# EAGLE design KwanBadgerStick (EAGLE 6.2)
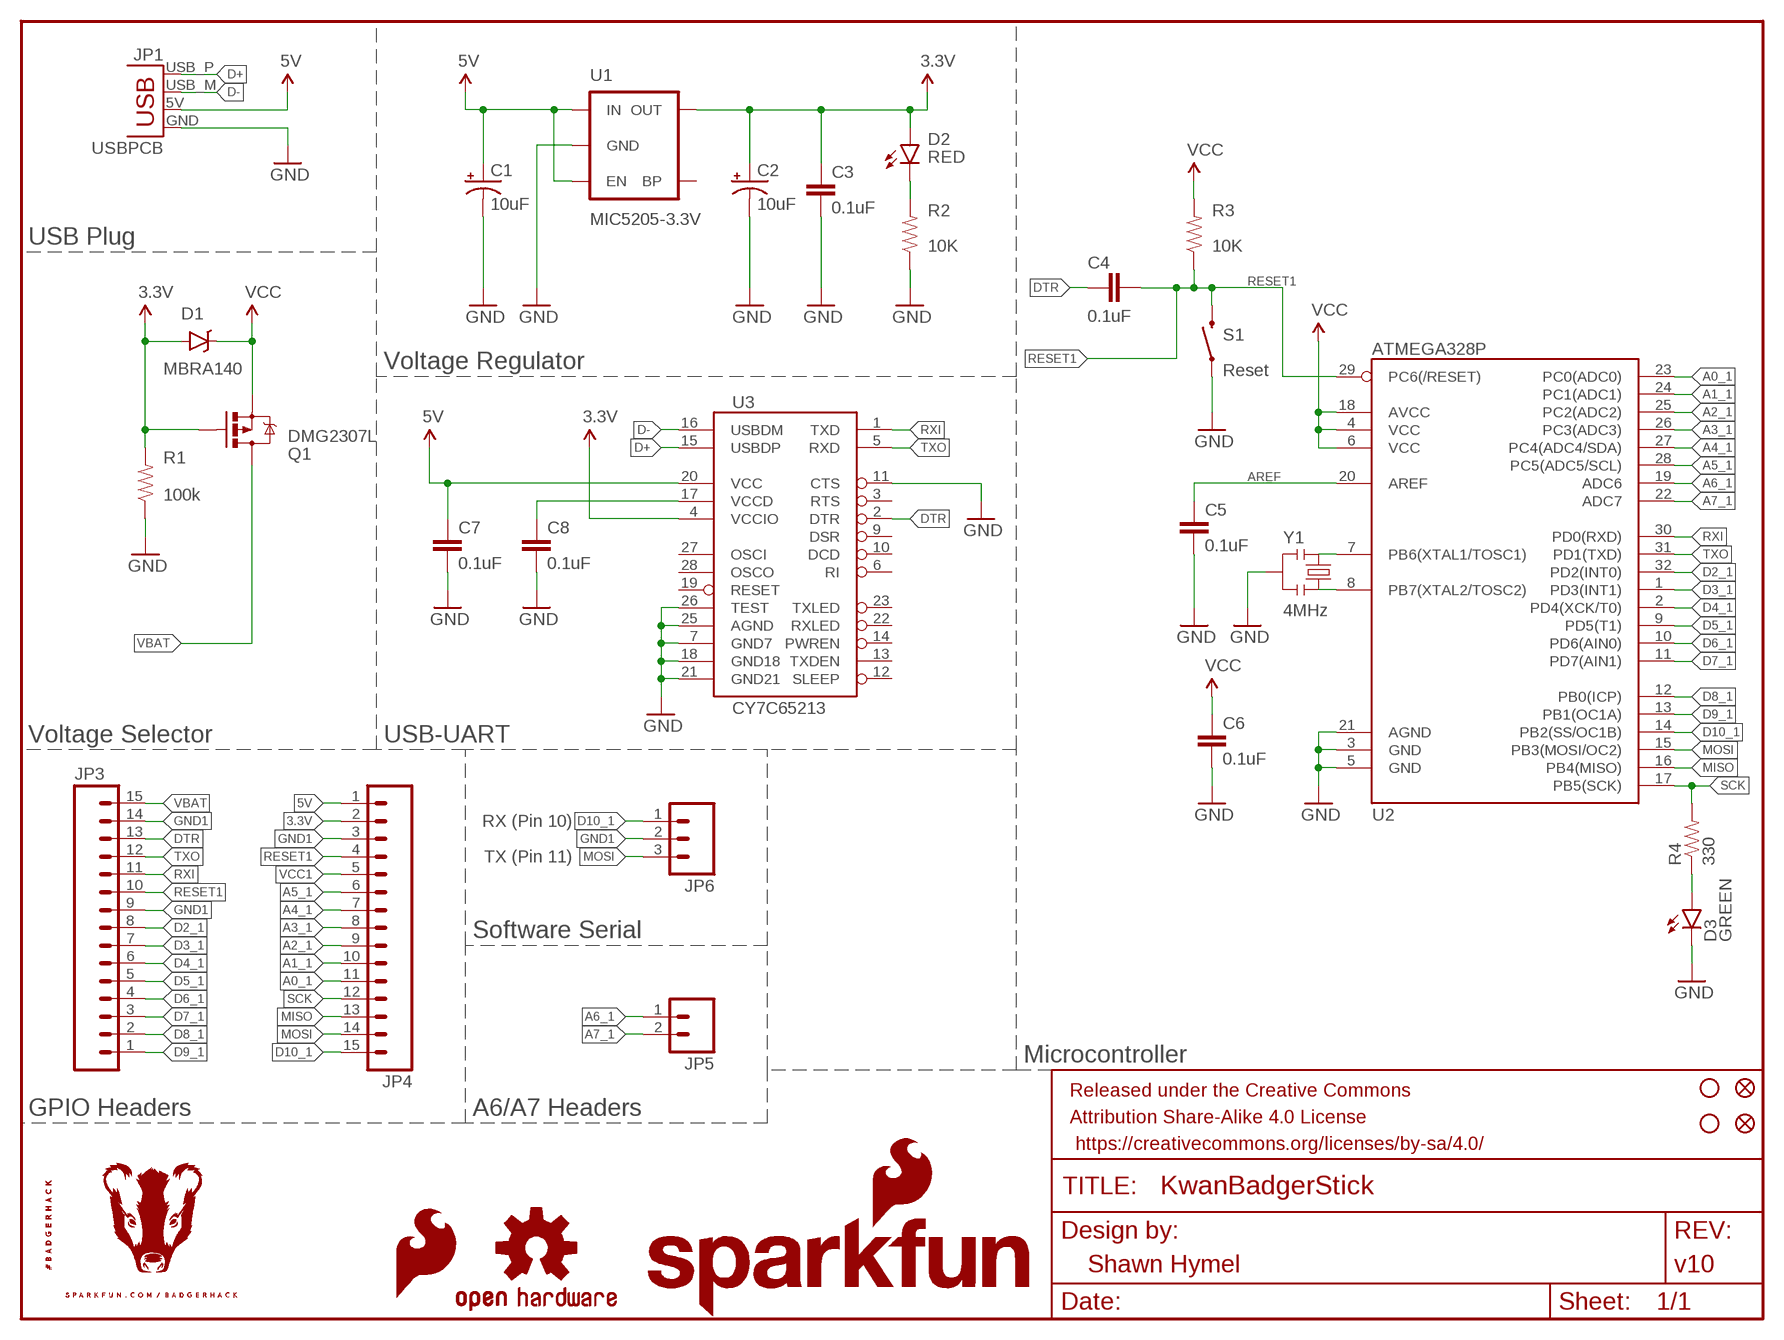
[diagram p0: schematic, sheet 1]

## Parts
C1  10uF  10UF-16V-10%(TANT)  [EIA3216]
C2  10uF  10UF-16V-10%(TANT)  [EIA3216]
C3  0.1uF  0.1UF-25V(+80/-20%)(0603)  [0603-CAP]
C4  0.1uF  0.1UF-25V(+80/-20%)(0603)  [0603-CAP]
C5  0.1uF  0.1UF-25V(+80/-20%)(0603)  [0603-CAP]
C6  0.1uF  0.1UF-25V(+80/-20%)(0603)  [0603-CAP]
C7  0.1uF  0.1UF-25V(+80/-20%)(0603)  [0603-CAP]
C8  0.1uF  0.1UF-25V(+80/-20%)(0603)  [0603-CAP]
D1  MBRA140  DIODE-SCHOTTKY-MBRA140  [SMA-DIODE]
D2  RED  LED-RED0603  [LED-0603]
D3  GREEN  LED-GREEN0603  [LED-0603]
FID1  FIDUCIAL1X2  [FIDUCIAL-1X2]
FID2  FIDUCIAL1X2  [FIDUCIAL-1X2]
FRAME1  FRAME-LETTER  [CREATIVE_COMMONS]
JP1  USBPCB  [USB-A-PCB]
JP3  M15LOCK_NO_SILK  [1X15_LOCK_NO_SILK]
JP4  M15LOCK_NO_SILK  [1X15_LOCK_NO_SILK]
JP5  M021X02_NO_SILK  [1X02_NO_SILK]
JP6  M03LOCK Female  M03LOCK_NO_SILK  [1X03_LOCK_NO_SILK]
LOGO1  SFE_LOGO_FLAME.1_INCH  [SFE_LOGO_FLAME_.1]
LOGO2  OSHW-LOGOS  [OSHW-LOGO-S]
Q1  DMG2307L  MOSFET-PCHANNELDMG2307L  [SOT23-3]
R1  100k  100KOHM-1/10W-1%(0603)  [0603-RES]
R2  10K  10KOHM-1/10W-1%(0603)0603  [0603-RES]
R3  10K  10KOHM-1/10W-1%(0603)0603  [0603-RES]
R4  330  330OHM1/10W1%(0603)  [0603-RES]
S1  SWITCH-MOMENTARY-2SMD-REDUNDANT  [TACTILE-SWITCH-SMD]
STANDOFF1  STAND-OFF  [STAND-OFF]
STANDOFF2  STAND-OFF  [STAND-OFF]
U1  MIC5205-3.3V  MIC52053.3V  [SOT23-5]
U2  ATMEGA328P  ATMEGA328_SMT  [TQFP32-08]
U3  CY7C65213  [SSOP28DB]
U$1  SFE_LOGO_NAME_FLAME.1_INCH  [SFE_LOGO_NAME_FLAME_.1]
U$2  BADGERHACK_LOGODUMMY  [DUMMY]
Y1  4MHz  RESONATOR4MHZ  [RESONATOR-SMD_MED]

## Nets
3.3V: C2.A(+) C3.1 D1.A D2.A JP4.2 Q1.1(G) R1.2 U1.5(OUT) U3.4(VCCIO)
5V: C1.A(+) C7.1 JP1.5V(VBUS) JP4.1 U1.1(IN) U1.3(EN) U3.20(VCC)
A0_1: JP4.11 U2.23(PC0(ADC0))
A1_1: JP4.10 U2.24(PC1(ADC1))
A2_1: JP4.9 U2.25(PC2(ADC2))
A3_1: JP4.8 U2.26(PC3(ADC3))
A4_1: JP4.7 U2.27(PC4(ADC4/SDA))
A5_1: JP4.6 U2.28(PC5(ADC5/SCL))
A6_1: JP5.1 U2.19(ADC6)
A7_1: JP5.2 U2.22(ADC7)
AREF: C5.1 U2.20(AREF)
D2_1: JP3.8 U2.32(PD2(INT0))
D3_1: JP3.7 U2.1(PD3(INT1))
D4_1: JP3.6 U2.2(PD4(XCK/T0))
D5_1: JP3.5 U2.9(PD5(T1))
D6_1: JP3.4 U2.10(PD6(AIN0))
D7_1: JP3.3 U2.11(PD7(AIN1))
D8_1: JP3.2 U2.12(PB0(ICP))
D9_1: JP3.1 U2.13(PB1(OC1A))
D10_1: JP4.15 JP6.1 U2.14(PB2(SS/OC1B))
D+: JP1.USB_P(D+) U3.15(USBDP)
D-: JP1.USB_M(D-) U3.16(USBDM)
DTR: C4.1 JP3.13 U3.2(DTR)
GND1: C1.C(-) C2.C(-) C3.2 C5.2 C6.2 C7.2 C8.2 D3.C JP1.GND JP3.9 JP3.14 JP4.3 JP6.2 R1.1 R2.1 S1.1 S1.2 U1.2(GND) U2.3(GND) U2.5(GND) U2.21(AGND) U3.7(GND7) U3.11(CTS) U3.18(GND18) U3.21(GND21) U3.25(AGND) U3.26(TEST) Y1.2 ; supply symbol labelled GND
MISO: JP4.13 U2.16(PB4(MISO))
MOSI: JP4.14 JP6.3 U2.15(PB3(MOSI/OC2))
N$1: D3.A R4.1
N$2: C8.1 U3.17(VCCD)
N$4: D2.C R2.2
N$5: U2.7(PB6(XTAL1/TOSC1)) Y1.1
N$6: U2.8(PB7(XTAL2/TOSC2)) Y1.3
RESET1: C4.2 JP3.10 JP4.4 R3.1 S1.3 S1.4 U2.29(PC6(/RESET))
RXI: JP3.11 U2.30(PD0(RXD)) U3.1(TXD)
SCK: JP4.12 R4.2 U2.17(PB5(SCK))
TXO: JP3.12 U2.31(PD1(TXD)) U3.5(RXD)
VBAT: JP3.15 Q1.3(D)
VCC1: C6.1 D1.C JP4.5 Q1.2(S) R3.2 U2.4(VCC) U2.6(VCC) U2.18(AVCC) ; supply symbol labelled VCC
Unconnected: U1.4(BP) U3.3(RTS) U3.6(RI) U3.9(DSR) U3.10(DCD) U3.12(SLEEP) U3.13(TXDEN) U3.14(PWREN) U3.19(RESET) U3.22(RXLED) U3.23(TXLED) U3.27(OSCI) U3.28(OSCO)

## Notes on the sheet
- USB Plug
- Voltage Regulator
- Voltage Selector | USB-UART
- RX (Pin 10)
- TX (Pin 11)
- Software Serial
- Microcontroller
- GPIO Headers | A6/A7 Headers

## Library data of the parts
C1 C2 = SparkFun-Capacitors:10UF-16V-10%(TANT): CAP-00811 1206/EIA-3216 Tantalum capacitor; PROD_ID: CAP-00811
C3-C8 = SparkFun-Capacitors:0.1UF-25V(+80/-20%)(0603): CAP-00810 Ceramic Standard decoupling cap; PROD_ID: CAP-00810
D1 = SparkFun-DiscreteSemi:DIODE-SCHOTTKY: Schottky diodes in SFE's production catalog BAT20J 1A 23V 0.62Vf RB751 120mA 40V 0.37Vf PMEG4005EJ 0.5A 40V 0.42Vf MBRA140 1A 40V 0.5Vf B340A 3A 40V SMA; PROD_ID: DIO-08053
D2 = SparkFun-LED:LED-RED: Assorted Red LEDs LilyPad 1206- DIO-09912 1206- DIO-00809 0603- DIO-00819; PROD_ID: DIO-00819
D3 = SparkFun-LED:LED-GREEN: Various green LEDs Green LEDs used in SFE Production 0603- DIO-00821 LARGE- DIO-00862 LILYPAD- DIO-09910; PROD_ID: DIO-00821
FID1 FID2 = SparkFun-Aesthetics:FIDUCIAL: Fiducial Alignment Points Various fiducial points for machine vision alignment.
FRAME1 = SparkFun-Aesthetics:FRAME-LETTER: Schematic Frame Standard 8.5x11 US Letter frame; DESIGNER: Shawn Hymel; VERSION: v10
JP1 = SparkFun-Connectors:USB: USB Connectors USB-B-PTH is fully proven SKU : PRT-00139/CONN-08278 USB-miniB is fully proven SKU : PRT-00587 USB-A-PCB is untested. USB-A-H is throughly reviewed, but untested. Spark Fun Electronics SKU : PRT-00437 USB-B-SMT is throughly reviewed, but untested. Needs silkscreen touching up. USB-A-S has not been used/tested USB-MB-H has not been used/tested USB-MICROB has been used. CONN-09505
JP3 JP4 = SparkFun-Connectors:M15: Header 15 Standard 15-pin 0.1" header. Use with straight break away headers (SKU : PRT-00116), right angle break away headers (PRT-00553), swiss pins (PRT-00743), machine pins (PRT-00117), and female headers (PRT-00115).
JP5 = SparkFun-Connectors:M02: Standard 2-pin 0.1" header. Use with - straight break away headers ( PRT-00116) - right angle break away headers (PRT-00553) - swiss pins (PRT-00743) - machine pins (PRT-00117) - female headers (PRT-00115) Molex polarized connector foot print use with: PRT-08233 with associated crimp pins and housings. 2.54_SCREWTERM for use with PRT-10571. 3.5mm Screw Terminal footprints for PRT-08084 5mm Screw Terminal footprints for use with PRT-08432
JP6 = SparkFun-Connectors:M03: Header 3 Standard 3-pin 0.1" header. Use with straight break away headers (SKU : PRT-00116), right angle break away headers (PRT-00553), swiss pins (PRT-00743), machine pins (PRT-00117), and female headers (PRT-00115). Molex polarized connector foot print use with SKU : PRT-08232 with associated crimp pins and housings.
LOGO1 = SparkFun-Aesthetics:SFE_LOGO_FLAME: SFE Logo, flame only This is the SparkFun flame logo. The logo on the schematic will always be the same size; the package variant is the height of the flame. Default layer for the logo on the board is tSilk.
LOGO2 = SparkFun-Aesthetics:OSHW-LOGO: Open Source Hardware Logo This logo indicates the piece of hardware it is found on incorporates a OSHW license and/or adheres to the definition of open source hardware found here: http://freedomdefined.org/OSHW
Q1 = SparkFun-DiscreteSemi:MOSFET-PCHANNEL: Generic PMOSFET IRLML2244 - TRANS-11153 (SOT-23 -20V -4.3A) (1.Gate 2.Source 3.Drain) FQP27P06 - COM-10349 <http://www.sparkfun.com/products/10349> (TO-220 -60V -27A) (1.Gate 2.Source 3.Drain); PROD_ID: TRANS-11308; VALUE: 2.5A/30V
R1 = SparkFun-Resistors:100KOHM-1/10W-1%(0603): RES-07828; PROD_ID: RES-07828
R2 R3 = SparkFun-Resistors:10KOHM-1/10W-1%(0603): RES-00824; PROD_ID: RES-00824
R4 = SparkFun-Resistors:330OHM1/10W1%(0603): RES-00818; PROD_ID: RES-00818
S1 = SparkFun-Electromechanical:SWITCH-MOMENTARY-2: Various NO switches- pushbuttons, reed, etc; FUNC: Reset; PROD_ID: SWCH-08247
STANDOFF1 STANDOFF2 = SparkFun-Electromechanical:STAND-OFF: #4 Stand Off This is the mechanical footprint for a #4 phillips button head screw. Use the keepout ring to avoid running the screw head into surrounding components. SKU : PRT-00447
U1 = SparkFun-PowerIC:MIC5205: MIC5205 150mA vreg 3.3V - VREG-00822 5V - VREG-00823; PROD_ID: VREG-00822
U2 = SparkFun-DigitalIC:ATMEGA328_SMT: 32-Pin Atmega328 part Commonly used on Arduino compatible boards Available in QFP and QFN packages TQFP is IC-09069 QFN is non-stock; PROD_ID: IC-09069
U3 = SparkFun-DigitalIC:CY7C65213: USB UART CY7C65213 USB-UART controller.; PROD_ID: IC-12487
U$1 = SparkFun-Aesthetics:SFE_LOGO_NAME_FLAME: SFE Logo, name and flame This is the SparkFun full logo. The logo on the schematic will always be the same size; the package variant is the height of the flame part of the logo. Default layer for the logo on the board is tSilk.
U$2 = SparkFun-Aesthetics:BADGERHACK_LOGO
Y1 = SparkFun-FreqCtrl:RESONATOR: Resonator Small SMD resonator. Used, eg, on the Arduino Pro/ Pro Mini boards. 8MHz- XTAL-08895 16MHz- XTAL-08900; PROD_ID: XTAL-12492

## Board
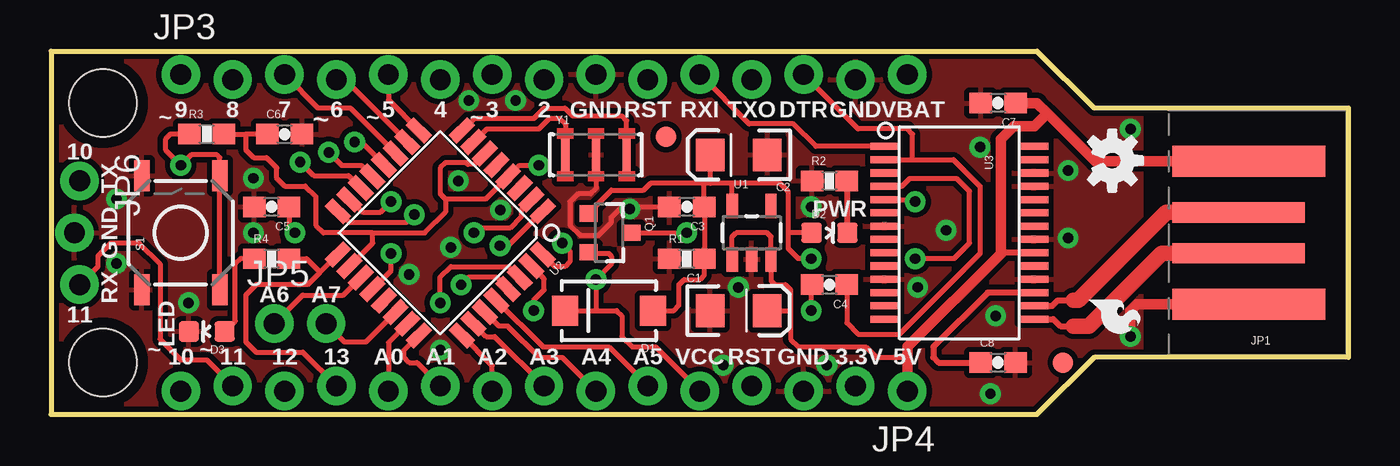
[diagram p1: board, top side]
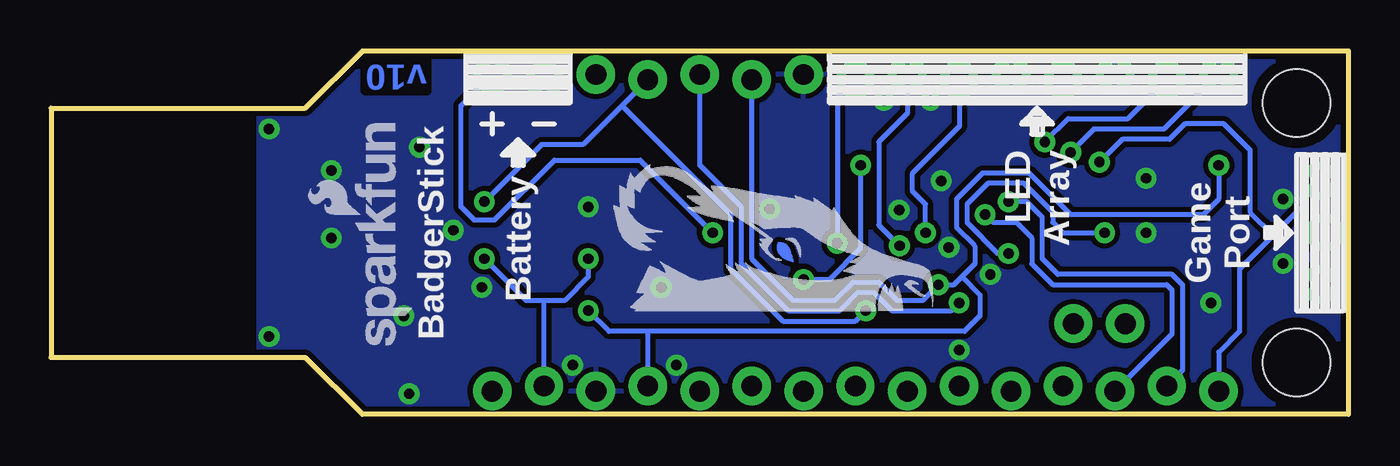
[diagram p2: board, bottom side, seen from below]

Size 63.5 x 17.78 mm. Coordinates in mm from the lower left corner, seen from the top.
Outline: 0,17.78 0,0 48.26,0 51.05,2.79 63.5,2.79 63.5,14.99 51.05,14.99 48.26,17.78 0,17.78
Copper layers (1*16): Top 0.035mm / dielectric 1.5mm / Bottom 0.035mm
Design rules: minimum track width 7mil, minimum drill 15mil, track to track 8mil, track to pad 8mil, pad to pad 8mil, via to via 8mil, smd to smd 8mil, copper to edge 8mil, drill to drill 8mil, minimum pad ring 12mil, minimum via ring 10mil, stop-mask expansion 4mil, vias tented up to drill 20mil, thermal gap 10mil
tRestrict: 3 lines

### Footprints (pad centres in the part's own frame; a part is rotated, then mirrored left to right if it is on the bottom)
EIA3216 = smd 1.4 x 1.6: A 1.4,0; C -1.4,0
0603-CAP = smd 1.1 x 1: 1 -0.85,0; 2 0.85,0
SMA-DIODE = smd 1.27 x 1.47: A -2.15,0; C 2.15,0
LED-0603 = smd 1 x 1: A 0,-0.877; C 0,0.877
FIDUCIAL-1X2 = smd 1 x 1: 1 0,0
USB-A-PCB = smd 7.5 x 1.5: 5V -0.2,-3.5; GND -0.2,3.5 | smd 6.5 x 1: USB_M 0.3,-1; USB_P 0.3,1
1X15_LOCK_NO_SILK = drill 1.016 pad 1.88: 1 0,0.127; 2 2.54,-0.127; 3 5.08,0.127; 4 7.62,-0.127; 5 10.16,0.127; 6 12.7,-0.127; 7 15.24,0.127; 8 17.78,-0.127; 9 20.32,0.127; 10 22.86,-0.127; 11 25.4,0.127; 12 27.94,-0.127; 13 30.48,0.127; 14 33.02,-0.127; 15 35.56,0.127
1X02_NO_SILK = drill 1.016 pad 1.88: 1 0,0; 2 2.54,0
1X03_LOCK_NO_SILK = drill 1.016 pad 1.88: 1 0,0.127; 2 2.54,-0.127; 3 5.08,0.127
SOT23-3 = smd 0.8 x 0.9: 1 -0.95,-1; 2 0.95,-1; 3 0,1.1
0603-RES = smd 1.1 x 1: 1 -0.85,0; 2 0.85,0
TACTILE-SWITCH-SMD = smd 1.524 x 0.762: 1 -2.794,1.905; 2 2.794,1.905; 3 -2.794,-1.905; 4 2.794,-1.905
STAND-OFF = hole 3.302: 0,0
SOT23-5 = smd 0.55 x 1.2: 1 -0.95,-1.3; 2 0,-1.3; 3 0.95,-1.3; 4 0.95,1.3; 5 -0.95,1.3
TQFP32-08 = smd 1.27 x 0.559: 1 -4.293,2.8; 2 -4.293,2; 3 -4.293,1.2; 4 -4.293,0.4; 5 -4.293,-0.4; 6 -4.293,-1.2; 7 -4.293,-2; 8 -4.293,-2.8; 17 4.293,-2.8; 18 4.293,-2; 19 4.293,-1.2; 20 4.293,-0.4; 21 4.293,0.4; 22 4.293,1.2; 23 4.293,2; 24 4.293,2.8 | smd 0.559 x 1.27: 9 -2.8,-4.293; 10 -2,-4.293; 11 -1.2,-4.293; 12 -0.4,-4.293; 13 0.4,-4.293; 14 1.2,-4.293; 15 2,-4.293; 16 2.8,-4.293; 25 2.8,4.293; 26 2,4.293; 27 1.2,4.293; 28 0.4,4.293; 29 -0.4,4.293; 30 -1.2,4.293; 31 -2,4.293; 32 -2.8,4.293
SSOP28DB = smd 0.348 x 1.397: 1 -4.225,-3.656; 2 -3.575,-3.656; 3 -2.925,-3.656; 4 -2.275,-3.656; 5 -1.625,-3.656; 6 -0.975,-3.656; 7 -0.325,-3.656; 8 0.325,-3.656; 9 0.975,-3.656; 10 1.625,-3.656; 11 2.275,-3.656; 12 2.925,-3.656; 13 3.575,-3.656; 14 4.225,-3.656; 15 4.225,3.656; 16 3.575,3.656; 17 2.925,3.656; 18 2.275,3.656; 19 1.625,3.656; 20 0.975,3.656; 21 0.325,3.656; 22 -0.325,3.656; 23 -0.975,3.656; 24 -1.625,3.656; 25 -2.275,3.656; 26 -2.925,3.656; 27 -3.575,3.656; 28 -4.225,3.656
RESONATOR-SMD_MED = smd 0.4 x 1.6: 1 -1.5,0; 2 0,0; 3 1.5,0

### Placement (x,y rotation side)
C1  33.66,5.08 0 top
C2  33.66,12.7 180 top
C3  31.11,10.16 180 top
C4  38.1,6.35 180 top
C5  10.79,10.16 180 top
C6  11.43,13.72 0 top
C7  46.35,15.24 180 top
C8  46.35,2.54 0 top
D1  27.3,5.08 180 top
D2  38.1,8.89 270 top
D3  7.62,4.06 90 top
FID1  30.1,13.59 270 top
FID2  49.53,2.54 270 top
FRAME1  87.63,5.08 0 top  (outside the outline)
JP1  58.42,8.89 180 top
JP3  6.35,16.51 0 top
JP4  41.91,1.27 180 top
JP5  10.92,4.45 0 top
JP6  1.27,11.43 270 top
LOGO1  50.42,5.94 270 top
LOGO2  51.94,12.42 270 top
Q1  27.3,8.89 270 top
R1  31.11,7.62 0 top
R2  38.1,11.43 0 top
R3  7.62,13.72 0 top
R4  10.79,7.62 0 top
S1  6.35,8.89 90 top
STANDOFF1  2.54,2.54 270 top
STANDOFF2  2.54,15.24 270 top
U1  34.29,8.89 0 top
U2  19.05,8.89 225 top
U3  44.45,8.89 270 top
U$1  45.72,2.92 90 bottom
U$2  -60.96,-31.75 0 top  (outside the outline)
U$3  [HALF_BADGER]  20.32,5.08 90 bottom
Y1  26.67,12.7 0 top

### Tracks (layer width: path | path; a pad name or v marks a point on that pad's centre or on a via)
3.3V  (via drill 0.51)
  Top 0.254: D2.A 36.07,8.89 | v37.21,7.62 36.58,7.62 36.07,8.13 36.07,8.89 | 36.07,8.89 36.07,10.92 35.69,11.3 33.27,11.3 | U3.4 41.65,11.16 42.04,11.56 44.32,11.56 44.96,10.92 44.96,8.38 44.2,7.62 v42.29,7.62 | 33.27,11.3 32.26,11.3 | 32.26,11.3 32,11.3 | 32,11.3 29.34,11.3 29.01,10.97 27.43,10.97 27.39,10.93 27.39,10.92 Q1.1 | U1.5 33.34,11.24 33.27,11.3 | 32,11.3 31.96,11.26 C3.1 31.96,9.69 32,9.65 32,8.13 31.96,8.09 R1.2 31.96,6.82 31.75,6.6 30.99,6.6 30.73,6.35 30.73,5.33 30.48,5.08 D1.A | C2.A 32.26,11.31 32.26,11.3
  Bottom 0.254: v37.21,7.62 37.21,6.73 38.35,5.59 39.37,5.59 | 39.37,5.59 40.26,5.59 v42.29,7.62 | JP4.2 39.37,5.59
5V
  Top 0.254: U1.1 33.34,8.7 33.53,8.89 35.05,8.89 35.24,8.7 U1.3 35.24,6.54 35.43,6.35 35.94,6.35 36.2,6.1 36.2,5.08 | 36.2,5.08 36.2,3.68 36.58,3.3 39.88,3.3 40.39,2.79 41.91,2.79 | C1.A 36.2,5.08
  Top 0.305: U3.20 46.52,7.92 46.48,7.87
  Top 0.508: JP1.5V 51.11,12.39 48.77,14.73 | 48.77,14.73 48.26,15.24 C7.1 | 48.77,14.73 48.13,14.1 47.12,14.1 46.48,13.46 46.48,7.87 41.91,3.3 41.91,2.79 JP4.1
A0_1
  Top 0.254: U2.23 16.51,3.52 JP4.11
A1_1
  Top 0.254: U2.24 17.27,3.15 17.27,2.79 17.53,2.54 17.91,2.54 JP4.10
A2_1
  Top 0.254: JP4.9 21.59,2.39 U2.25
A3_1
  Top 0.254: U2.26 21.3,3.81 21.72,3.81 JP4.8
A4_1
  Top 0.254: U2.27 21.93,4.32 22.35,4.32 23.88,2.79 25.02,2.79 JP4.7
A5_1
  Top 0.254: U2.28 24.07,3.3 27.3,3.3 JP4.6
A6_1
  Top 0.254: U2.19 14.3,5.84 12.32,5.84 JP5.1
A7_1
  Top 0.254: U2.22 15.41,3.56 14.35,3.56 JP5.2
AREF  (via drill 0.51)
  Top 0.254: U2.20 16.64,7.04 v16.64,7.87 | C5.1 11.64,9.18 v11.94,8.89
  Bottom 0.254: v16.64,7.87 17.14,7.87 18.67,9.4 18.67,10.29 17.65,11.3 15.88,11.3 14.48,9.91 14.48,9.4 13.97,8.89 v11.94,8.89
D2_1  (via drill 0.51)
  Top 0.254: v25.02,8.38 25.4,8 25.4,7.49 25.15,7.24 24.66,7.24 U2.32
  Bottom 0.254: JP3.8 25.02,15.49 v25.02,8.38
D3_1  (via drill 0.51)
  Top 0.254: U2.1 22.38,8.26 v21.97,8.26
  Bottom 0.254: JP3.7 21.59,14.73 22.99,13.34 22.99,9.27 v21.97,8.26
D4_1  (via drill 0.51)
  Top 0.254: U2.2 23.5,10.47 23.01,9.98 23.01,9.68 22.45,9.12 20.93,9.12 v20.7,8.89
  Bottom 0.254: v20.7,8.89 20.7,10.29 21.34,10.92 21.34,11.81 19.05,14.1 JP3.6
D5_1
  Top 0.254: U2.9 16.51,15.39 JP3.5
D6_1
  Top 0.254: JP3.4 14.38,16.38 U2.10
D7_1
  Top 0.254: U2.11 14.65,14.99 13.08,14.99 JP3.3
D8_1  (via drill 0.51)
  Top 0.254: v14.86,13.34 15.17,13.34 U2.12
  Bottom 0.254: v14.86,13.34 13.72,14.48 10.79,14.48 JP3.2
D9_1  (via drill 0.51)
  Top 0.254: v13.59,12.83 14.22,12.19 15.18,12.19 U2.13
  Bottom 0.254: v13.59,12.83 12.45,13.97 9.02,13.97 JP3.1
D10_1  (via drill 0.51)
  Top 0.254: U2.14 14.56,11.68 12.85,11.68 v12.19,12.34
  Bottom 0.254: v12.19,12.34 11.07,13.46 8.76,13.46 8,14.22 6.1,14.22 4.83,12.95 4.83,9.91 3.68,8.76 | JP4.15 6.35,3.05 5.33,4.06 5.33,7.11 3.68,8.76 | JP6.1 2.29,10.54 2.29,10.16 3.68,8.76
D+
  Top 0.305: U3.15 49.06,4.67 49.4,4.32 50.04,4.32
  Top 0.762: JP1.USB_P 54.37,7.89 50.8,4.32 50.04,4.32
D-
  Top 0.305: U3.16 49,5.32 49.28,5.59 50.04,5.59
  Top 0.762: 50.04,5.59 50.29,5.59 54.59,9.89 JP1.USB_M
DTR
  Top 0.254: U3.2 42.16,12.46 | 42.16,12.46 42.16,13.72 41.91,13.97 39.5,13.97 JP3.13 | C4.1 38.95,4.48 39.5,3.94 41.53,3.94 45.47,7.87 45.47,11.18 44.18,12.46 42.16,12.46
GND1  (via drill 0.51)
  Top 0.254: Y1.2 26.67,11.05 26.42,10.79 25.78,10.79 25.4,10.41 25.4,9.27 25.91,8.76 26.8,8.76 27.43,9.4 27.43,9.65 27.94,10.16 C3.2
  Top 0.508: JP1.GND 53.14,5.39 52.83,5.08 v52.83,3.81
  other vias: 22,10.01 19.94,11.43 19.56,8.18 17.53,6.86 49.78,11.94 49.78,8.64 45.47,13.08 46.23,4.83 45.97,1.02 42.42,6.22 43.81,9.02 37.21,10.16 19.05,3.15 52.83,13.97 3.2,10.54 3.2,7.39 6.73,5.46 9.91,8.89 9.91,11.56 22.73,15.37 20.45,15.37 37.97,2.41 32.89,2.41 33.64,6.22 28.32,10.06
  pour Top (isolate 0.254): 51.05,14.99 53.34,14.99 53.34,2.79 51.05,2.79 48.26,0 0,0 0,17.78 48.26,17.78
  pour Bottom (isolate 0.254): 51.05,14.99 53.34,14.99 53.34,2.79 51.05,2.79 48.26,0 0,0 0,17.78 48.26,17.78
MISO  (via drill 0.51)
  Top 0.254: U2.16 14.06,9.95 14.61,9.4 17.4,9.4 v17.78,9.78
  Bottom 0.254: v17.78,9.78 17.4,9.4 16.26,9.4 15.49,8.64 15.49,7.37 14.48,6.35 8.89,6.35 8.64,6.1 8.64,3.94 JP4.13
MOSI  (via drill 0.51)
  Top 0.254: U2.15 14.63,10.51 15.24,9.91 16.13,9.91 v16.64,10.41 | JP4.14 7.62,2.67 6.35,2.67 5.33,3.68 5.33,7.37 4.32,8.38 2.92,8.38 2.29,7.75 2.29,7.24 JP6.3
  Bottom 0.254: v16.64,10.41 15.75,10.41 14.99,9.65 14.99,7.62 14.22,6.86 8.64,6.86 8.13,6.35 8.13,2.16 JP4.14
N$1
  Top 0.254: R4.1 9.27,7.62 9.02,7.37 9.02,4.57 D3.A
N$2
  Top 0.305: U3.17 45.84,5.96 43.18,3.3 43.18,2.79 43.43,2.54 C8.1
N$4
  Top 0.305: R2.2 38.95,8.92 D2.C
N$5
  Top 0.254: U2.7 20.71,13.34 21.34,13.97 23.88,13.97 24.38,14.48 24.89,14.48 25.17,14.2 Y1.1
N$6
  Top 0.254: U2.8 20.13,13.9 20.7,14.48 23.62,14.48 24.13,14.99 25.15,14.99 25.53,14.61 27.94,14.61 28.17,14.38 Y1.3
RESET1  (via drill 0.51)
  Top 0.254: v20.07,6.35 20.45,6.73 21.77,6.73 U2.29 | v37.21,5.08 37.21,6.31 | S1.3 S1.4 8.26,12.57 8.13,12.7 6.86,12.7 v6.35,12.19 5.59,12.95 5.59,13.46 5.84,13.72 R3.1
  Top 0.305: 37.21,6.31 C4.2
  Bottom 0.254: 18.92,6.73 18.29,7.37 18.29,8.26 19.18,9.14 19.18,10.54 17.91,11.81 15.62,11.81 13.59,9.78 7.11,9.78 6.35,10.54 v6.35,12.19 | 18.92,6.73 18.03,5.84 18.03,4.83 18.8,4.06 34.29,4.06 | 18.92,6.73 19.3,6.35 v20.07,6.35 20.83,5.59 22.1,5.59 22.99,6.48 24.26,6.48 25.15,5.59 27.18,5.59 29.21,7.62 JP3.10 | 34.29,4.06 36.2,4.06 v37.21,5.08 | JP4.4 34.29,4.06
RXI  (via drill 0.51)
  Top 0.254: v19.05,5.46 19.05,6.73 19.56,7.24 22.4,7.24 U2.30 | U3.1 37.43,13.12 36.32,14.22 34.16,14.22 JP3.11
  Bottom 0.254: v19.05,5.46 19.43,5.08 22.35,5.08 23.24,5.97 24,5.97 24.89,5.08 27.43,5.08 29.72,7.37 29.72,10.16 31.75,12.19 JP3.11
SCK
  Top 0.254: R4.2 12.5,7.62 13.16,6.96 | JP4.12 12.32,3.05 10.03,3.05 9.53,3.56 9.53,5.84 10.03,6.35 12.55,6.35 13.16,6.96 | 13.16,6.96 U2.17
TXO  (via drill 0.51)
  Top 0.254: U3.5 42.19,10.52 v42.29,10.41 | v23.62,5.08 23.62,5.59 24.13,6.1 24.13,6.64 U2.31
  Bottom 0.254: v42.29,10.41 39.5,13.21 37.47,13.21 35.56,15.11 | 35.56,15.11 30.23,9.78 30.23,7.11 27.69,4.57 24.13,4.57 v23.62,5.08 | JP3.12 35.56,15.11
VBAT  (via drill 0.51)
  Top 0.254: Q1.3 v31.11,8.89
  Bottom 0.254: JP3.15 43.43,15.11 43.43,10.16 42.8,9.53 41.78,9.53 38.86,12.45 34.67,12.45 v31.11,8.89
VCC1  (via drill 0.51)
  Top 0.254: U2.6 21.24,12.75 20.73,12.24 20.4,12.24 20.32,12.32 19.3,12.32 19.05,12.06 19.05,10.79 19.3,10.54 | 19.3,10.54 21.27,10.54 U2.4 22.92,12.19 v23.88,12.19 | 19.3,10.54 19.3,9.91 18.29,8.89 15.75,8.89 | U2.18 14.63,7.27 15.75,8.38 15.75,8.89 | 15.75,8.89 13.34,8.89 12.95,9.27 12.95,10.67 12.45,11.18 11.43,11.18 11.05,11.56 11.05,12.06 10.54,12.57 9.91,12.57 9.53,12.95 9.53,13.72 | R3.2 9.53,13.72 | C6.1 9.53,13.72 | Q1.2 26.37,7.87 27.3,7.87 27.43,7.75 27.43,7.37 v26.67,6.6 26.67,5.08 | D1.C 26.67,5.08 | JP4.5 29.59,3.3 28.45,3.3 27.94,3.81 27.94,4.83 27.69,5.08 26.67,5.08
  Bottom 0.254: v23.88,12.19 23.88,8.13 25.4,6.6 v26.67,6.6

### Text on the board
tPlace: ~ | 9 | 8 | 7 | ~ | 6 | ~ | 5 | 4 | ~ | 3 | 2 | GND | RST | RXI | TXO | DTR | GND | VBAT | 10 | TX | PWR | GND | RX | 11 | A6 | A7 | LED | ~ | ~ | 10 | 11 | 12 | 13 | A0 | A1 | A2 | A3 | A4 | A5 | VCC | RST | GND | 3.3V | 5V
bPlace: LED / Array | Battery | Game / Port | BadgerStick